# EAGLE design 5_pin_Motor_Control_Board (EAGLE 9.6.2)
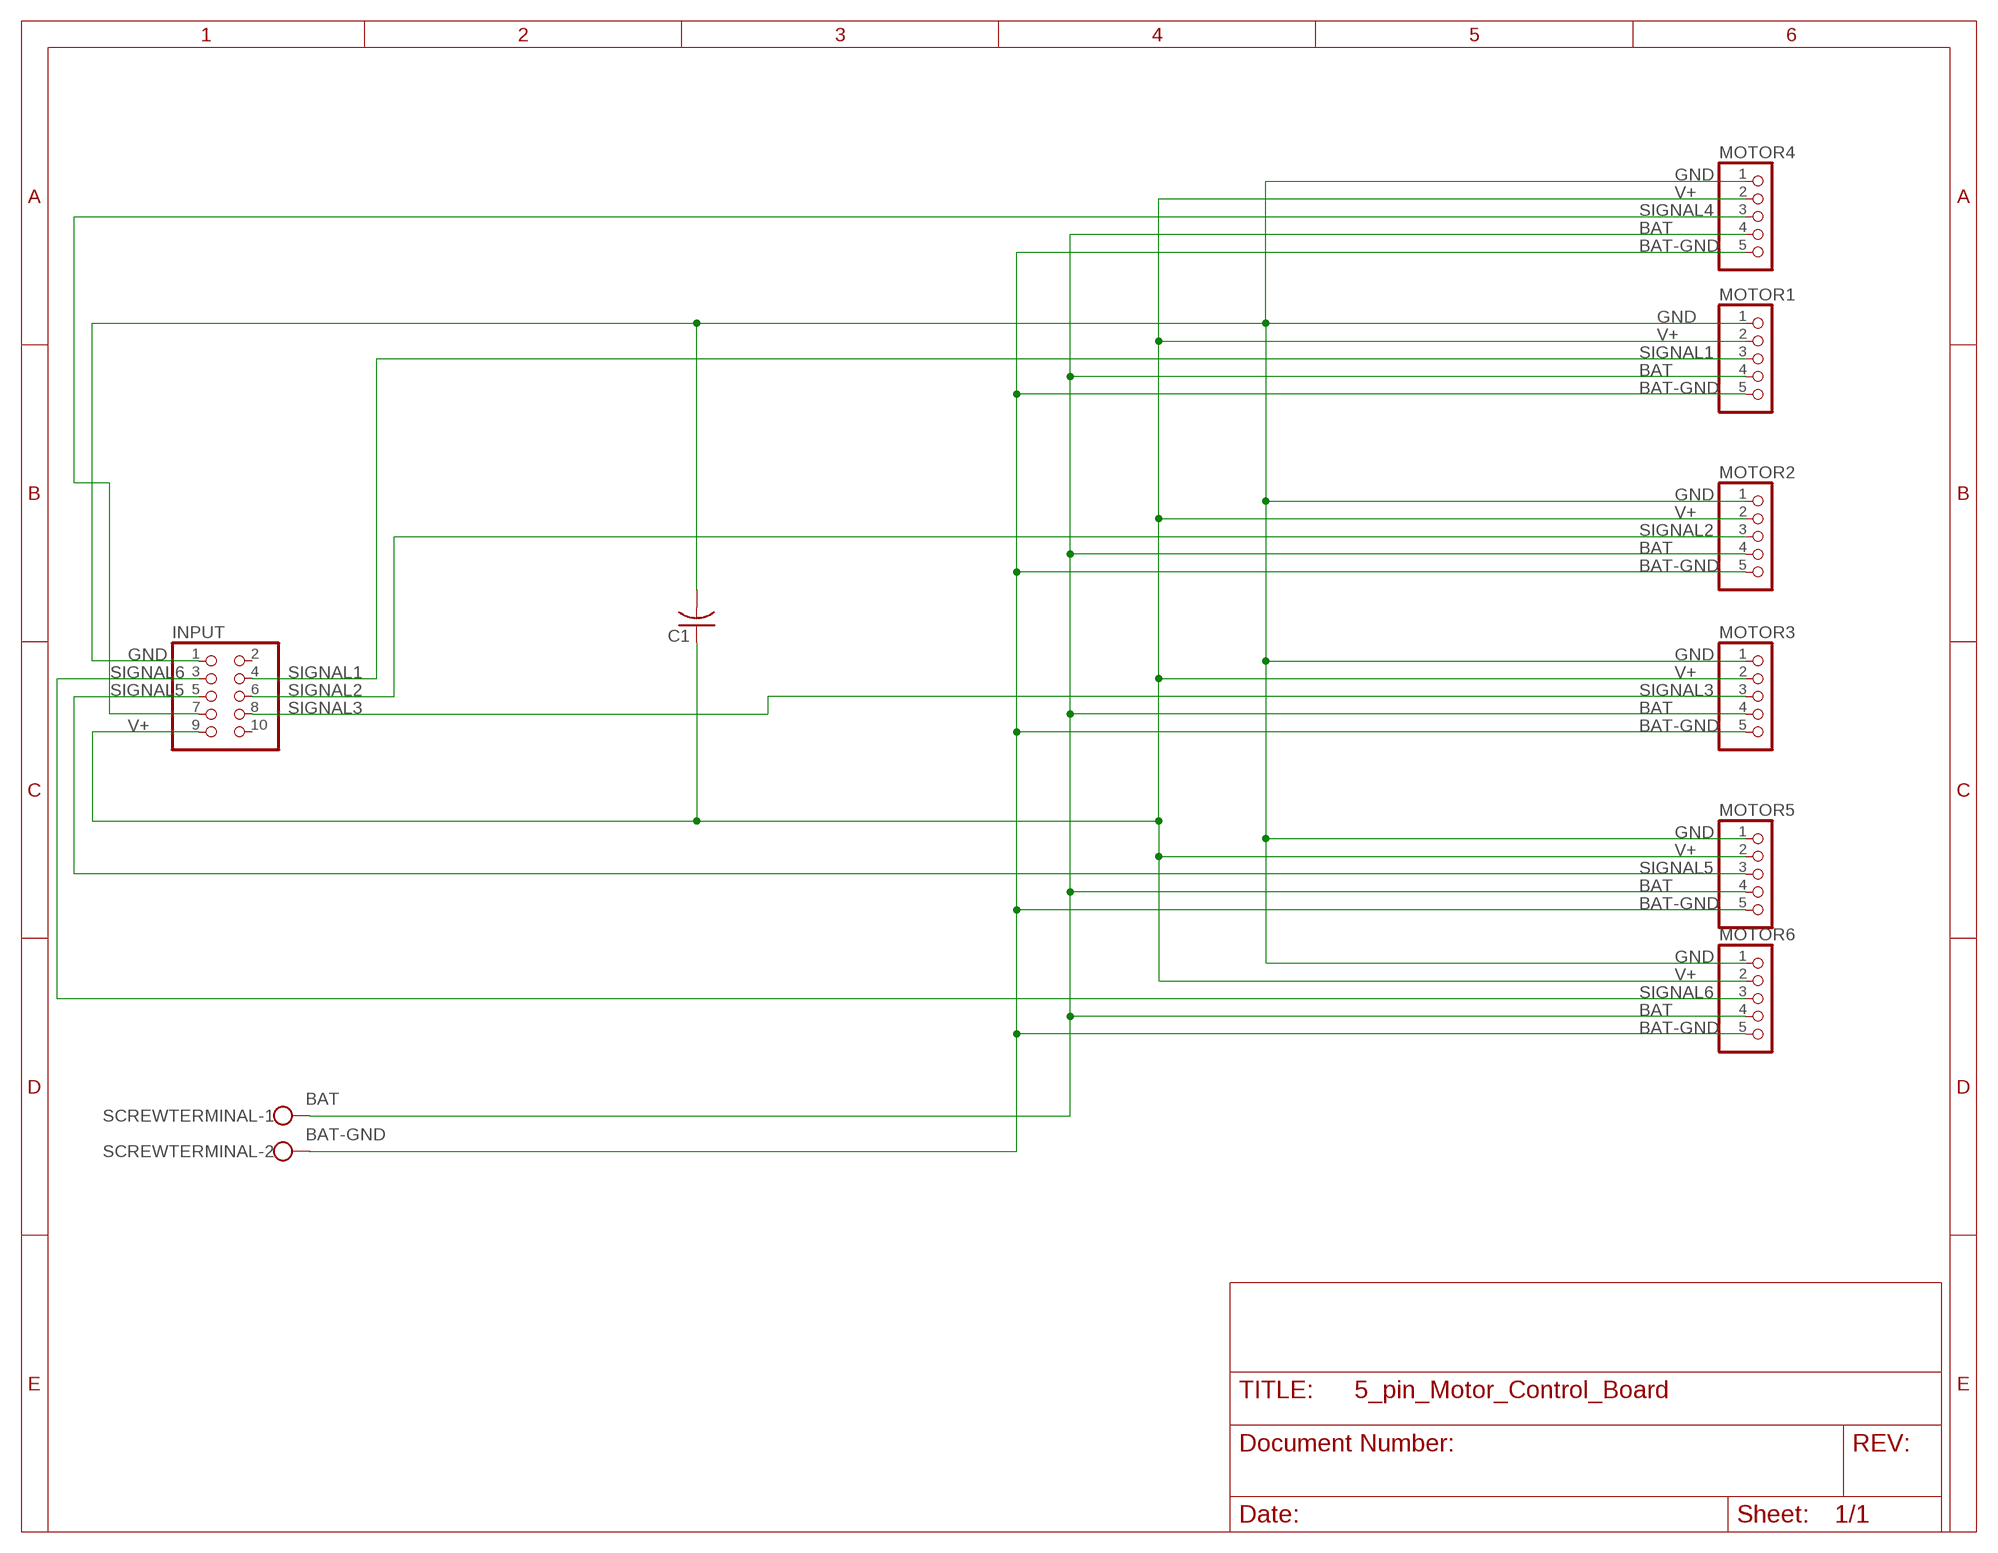
[diagram p0: schematic, sheet 1]

## Parts
C1  C-US025-025X050  [C025-025X050]
INPUT  PINHD-2X5  [2X05]
MOTOR1  PINHD-1X5  [1X05]
MOTOR2  PINHD-1X5  [1X05]
MOTOR3  PINHD-1X5  [1X05]
MOTOR4  PINHD-1X5  [1X05]
MOTOR5  PINHD-1X5  [1X05]
MOTOR6  PINHD-1X5  [1X05]
SCREWTERMINAL  W237-102  [W237-102]

## Nets
BAT: MOTOR1.4 MOTOR2.4 MOTOR3.4 MOTOR4.4 MOTOR5.4 MOTOR6.4 SCREWTERMINAL.1
BAT-GND: MOTOR1.5 MOTOR2.5 MOTOR3.5 MOTOR4.5 MOTOR5.5 MOTOR6.5 SCREWTERMINAL.2
GND: C1.2 INPUT.1 MOTOR1.1 MOTOR2.1 MOTOR3.1 MOTOR4.1 MOTOR5.1 MOTOR6.1
SIGNAL1: INPUT.4 MOTOR1.3
SIGNAL2: INPUT.6 MOTOR2.3
SIGNAL3: INPUT.8 MOTOR3.3
SIGNAL4: INPUT.7 MOTOR4.3
SIGNAL5: INPUT.5 MOTOR5.3
SIGNAL6: INPUT.3 MOTOR6.3
V+: C1.1 INPUT.9 MOTOR1.2 MOTOR2.2 MOTOR3.2 MOTOR4.2 MOTOR5.2 MOTOR6.2
Unconnected: INPUT.2 INPUT.10

## Library data of the parts
C1 = rcl:C-US: CAPACITOR, American symbol; SPICEPREFIX: C
INPUT = pinhead:PINHD-2X5: PIN HEADER
MOTOR1-MOTOR6 = pinhead:PINHD-1X5: PIN HEADER
SCREWTERMINAL = con-wago-500:W237-102: WAGO SCREW CLAMP; MPN: 237-102; OC_FARNELL: unknown; OC_NEWARK: 70K9898

## Board
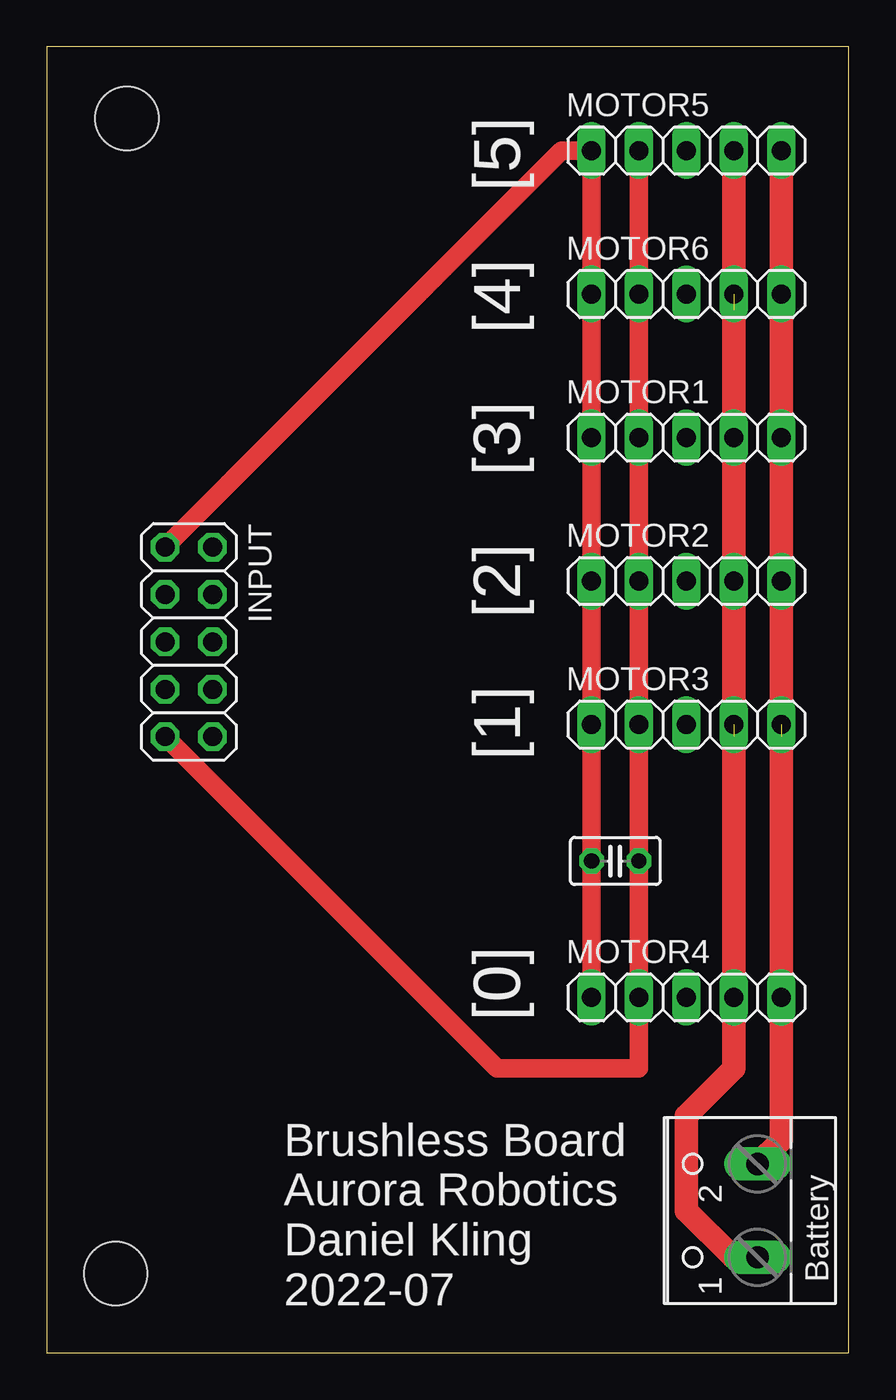
[diagram p1: board, top side]
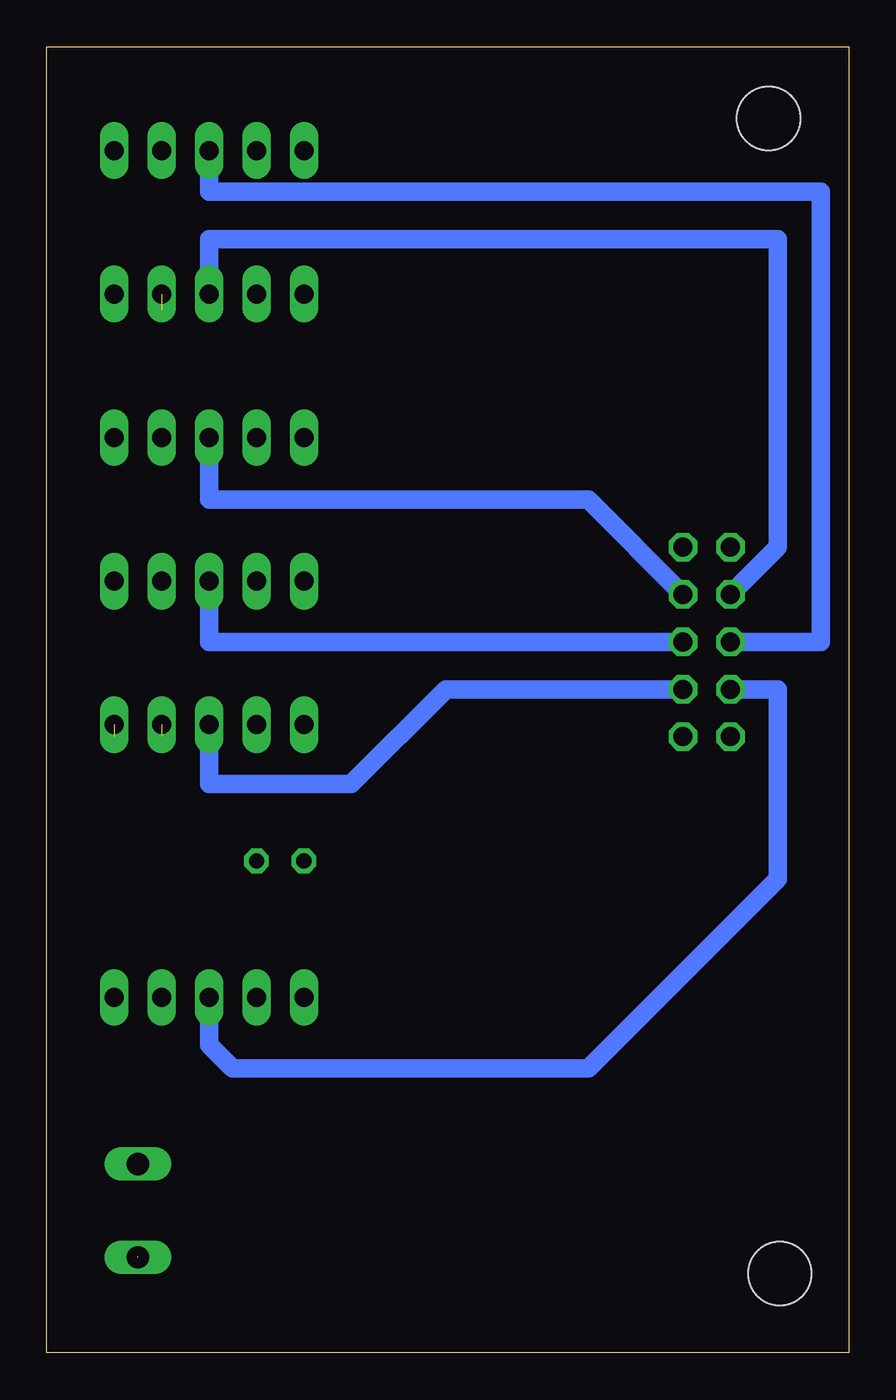
[diagram p2: board, bottom side, seen from below]

Size 43 x 70 mm. Coordinates in mm from the lower left corner, seen from the top.
Outline: 43,0 43,70 0,70 0,0 43,0
Copper layers (1*16): Top 0.035mm / dielectric 1.5mm / Bottom 0.035mm
Design rules "default": minimum track width 6mil, minimum drill 0.35mm, track to track 6mil, track to pad 6mil, pad to pad 6mil, via to via 6mil, smd to smd 6mil, copper to edge 40mil, drill to drill 6mil, minimum pad ring 10mil, minimum via ring 8mil, stop-mask expansion 4mil, vias tented up to drill 0mil, thermal gap 10mil
Holes 3.4 mm at 4.3,66.16 3.7,4.25

### Footprints (pad centres in the part's own frame; a part is rotated, then mirrored left to right if it is on the bottom)
C025-025X050 = drill 0.813 octagon: 1 -1.27,0; 2 1.27,0
2X05 = drill 1.016 octagon: 1 -5.08,-1.27; 2 -5.08,1.27; 3 -2.54,-1.27; 4 -2.54,1.27; 5 0,-1.27; 6 0,1.27; 7 2.54,-1.27; 8 2.54,1.27; 9 5.08,-1.27; 10 5.08,1.27
1X05 = drill 1.016 long: 1 -5.08,0; 2 -2.54,0; 3 0,0; 4 2.54,0; 5 5.08,0
W237-102 = drill 1.194 long: 1 -2.5,-1.27; 2 2.5,-1.27

### Placement (x,y rotation side)
C1  30.48,26.36 180 top
INPUT  7.62,38.1 270 top
MOTOR1  34.29,49.05 0 top
MOTOR2  34.29,41.36 0 top
MOTOR3  34.29,33.67 0 top
MOTOR4  34.29,19.05 0 top
MOTOR5  34.29,64.43 0 top
MOTOR6  34.29,56.74 0 top
SCREWTERMINAL  36.83,7.62 90 top

### Tracks (layer width: path | path; a pad name or v marks a point on that pad's centre or on a via)
BAT  (3 unrouted)
  Top 1.27: 38.12,5.14 36.77,5.14 34.29,7.62 34.29,12.7 36.83,15.24 MOTOR4.4 MOTOR3.4 | MOTOR5.4 36.83,55.88 | MOTOR6.4 MOTOR1.4 MOTOR2.4 36.83,33.02
BAT-GND  (1 unrouted)
  Top 1.27: SCREWTERMINAL.2 39.37,11.39 MOTOR4.5 MOTOR3.5 | MOTOR5.5 MOTOR6.5 MOTOR1.5 MOTOR2.5 39.37,33.02
GND
  Top 1: INPUT.1 27.6,64.43 MOTOR5.1 MOTOR6.1 MOTOR1.1 MOTOR2.1 MOTOR3.1 C1.2 MOTOR4.1
SIGNAL1
  Bottom 1: INPUT.4 13.97,45.72 34.29,45.72 MOTOR1.3
SIGNAL2
  Bottom 1: INPUT.6 34.29,38.1 MOTOR2.3
SIGNAL3
  Bottom 1: INPUT.8 21.59,35.56 26.67,30.48 34.29,30.48 MOTOR3.3
SIGNAL4
  Bottom 1: INPUT.7 3.81,35.56 3.81,25.4 13.97,15.24 33.02,15.24 34.29,16.51 MOTOR4.3
SIGNAL5
  Bottom 1: INPUT.5 1.52,38.1 1.52,62.23 34.29,62.23 MOTOR5.3
SIGNAL6
  Bottom 1: MOTOR6.3 34.29,59.69 3.81,59.69 3.81,43.18 INPUT.3
V+
  Top 1: INPUT.9 24.13,15.24 31.75,15.24 MOTOR4.2 C1.1 MOTOR3.2 MOTOR2.2 MOTOR1.2 MOTOR6.2 MOTOR5.2

### Text on the board
tPlace: [5] | [4] | [3] | [2] | [1] | [0] | Battery | Brushless Board / Aurora Robotics / Daniel Kling / 2022-07